# Altium project SAM-M8Q-Breakout.PrjPcb
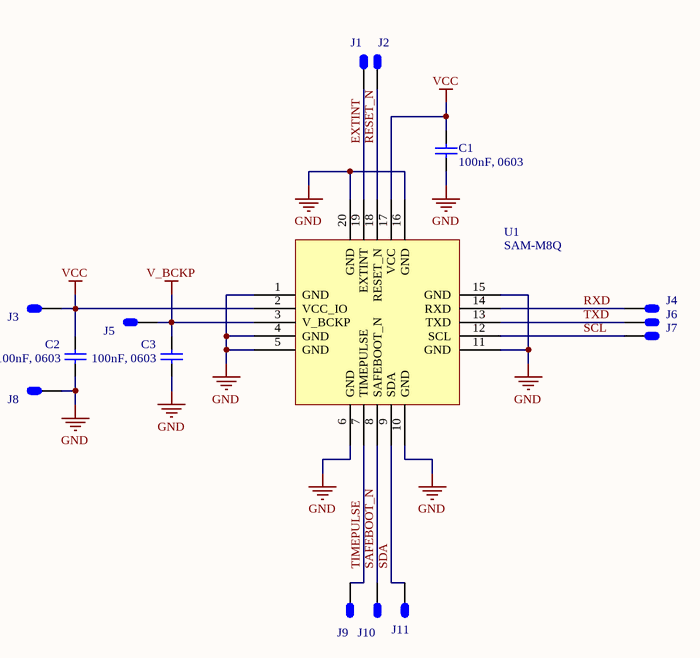
[diagram p0: Sheet1.SchDoc]
1 sheet, 15 parts. Net scope: global (net labels, ports and power ports of the same name join across sheets).

## Sheet Sheet1.SchDoc
size A4

### Parts
C1  100nF, 0603  [Capacitor 0603]
C2  100nF, 0603  [Capacitor 0603]
C3  100nF, 0603  [Capacitor 0603]
J1  Wire To Board Solder Pad  [Wire To Board Solder Pad]  (value not drawn)
J2  Wire To Board Solder Pad  [Wire To Board Solder Pad]  (value not drawn)
J3  Wire To Board Solder Pad  [Wire To Board Solder Pad]  (value not drawn)
J4  Wire To Board Solder Pad  [Wire To Board Solder Pad]  (value not drawn)
J5  Wire To Board Solder Pad  [Wire To Board Solder Pad]  (value not drawn)
J6  Wire To Board Solder Pad  [Wire To Board Solder Pad]  (value not drawn)
J7  Wire To Board Solder Pad  [Wire To Board Solder Pad]  (value not drawn)
J8  Wire To Board Solder Pad  [Wire To Board Solder Pad]  (value not drawn)
J9  Wire To Board Solder Pad  [Wire To Board Solder Pad]  (value not drawn)
J10  Wire To Board Solder Pad  [Wire To Board Solder Pad]  (value not drawn)
J11  Wire To Board Solder Pad  [Wire To Board Solder Pad]  (value not drawn)
U1  SAM-M8Q  [SAM-M8Q]

### Nets
GND: C1.1 C2.1 C3.1 J8.1 U1.1(GND) U1.4(GND) U1.5(GND) U1.6(GND) U1.10(GND) U1.11(GND) U1.15(GND) U1.16(GND) U1.20(GND)
V_BCKP: C3.2 J5.1 U1.3(V_BCKP)
VCC: C1.2 C2.2 J3.1 U1.2(VCC_IO) U1.17(VCC)
EXTINT: J1.1 U1.19(EXTINT)
RESET_N: J2.1 U1.18(RESET_N)
RXD: J4.1 U1.14(RXD)
SAFEBOOT_N: J10.1 U1.8(SAFEBOOT_N)
SCL: J7.1 U1.12(SCL)
SDA: J11.1 U1.9(SDA)
TIMEPULSE: J9.1 U1.7(TIMEPULSE)
TXD: J6.1 U1.13(TXD)

### Library data of the parts
C1-C3 = Capacitor